# Altium project PCB_Project.PrjPcb
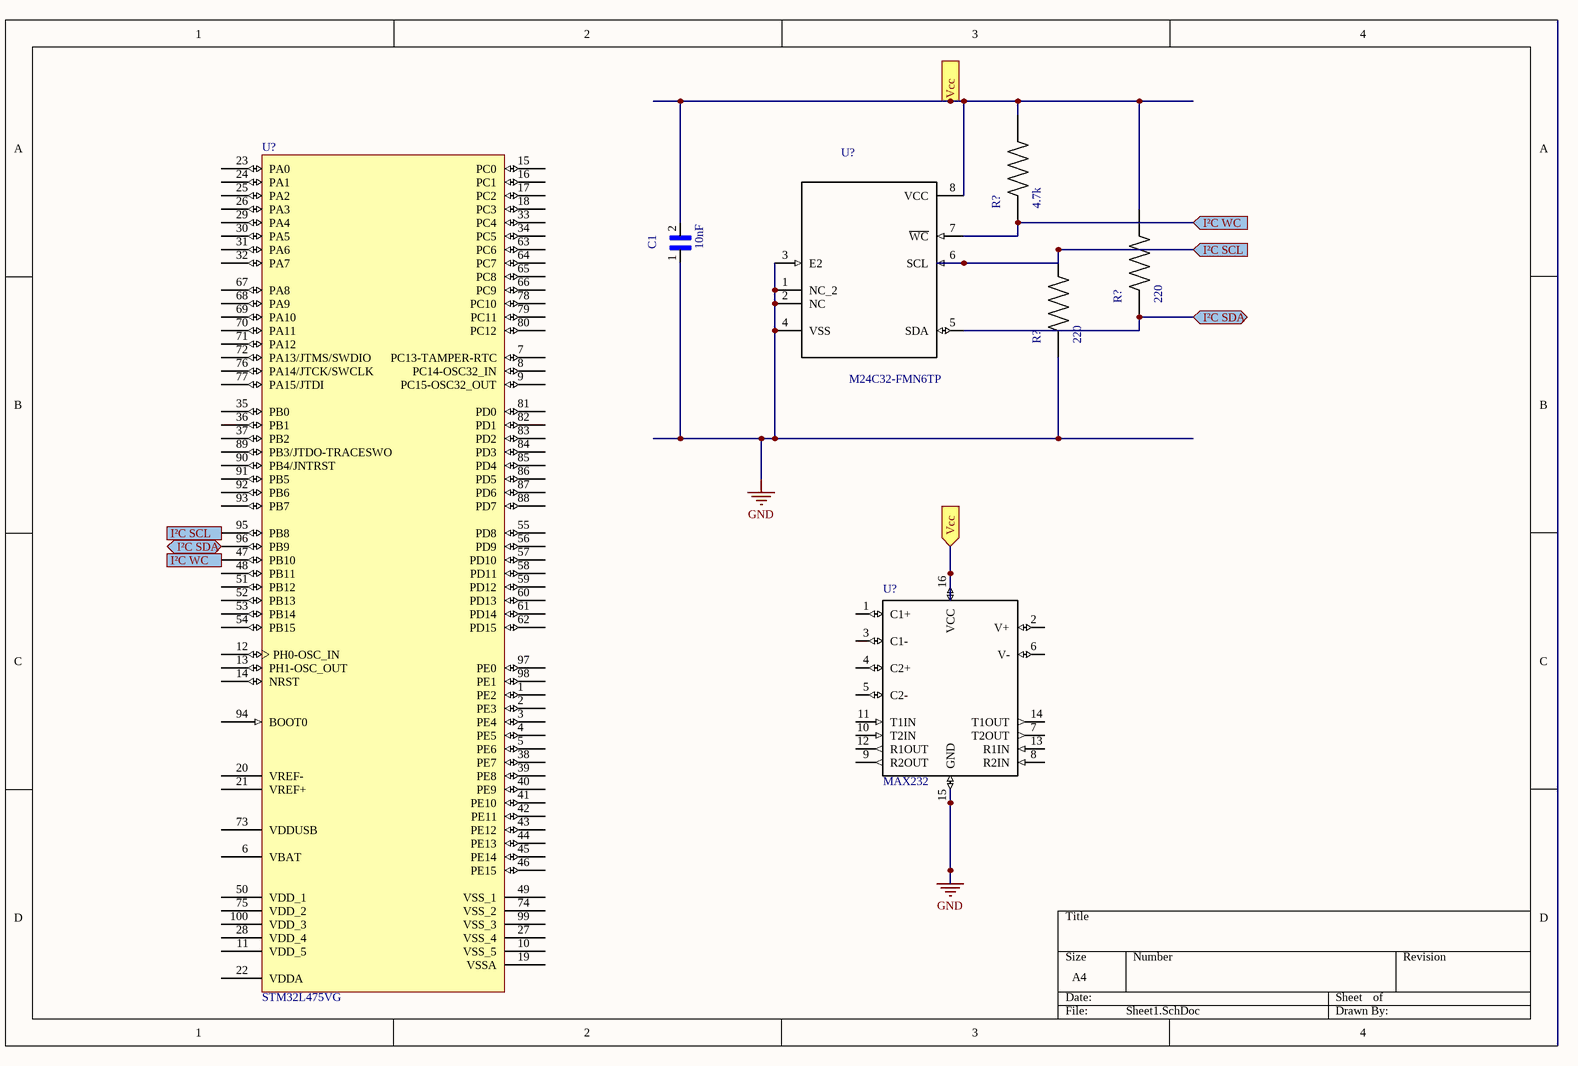
[diagram p0: Sheet1.SchDoc]
1 sheet, 7 parts. Net scope: flat (ports and power ports of the same name join across sheets).
Board file: PCB1.PcbDoc

## Sheet Sheet1.SchDoc
size A4

### Parts
(Parts that share a designator on the sheet are numbered #1, #2 ... from top to bottom, then left to right.)
C1  10nF  [*CAPC2012X88N]
R?#1  4.7k  [*RESC2012X65N]
R?#2  220  [*RESC2012X65N]
R?#3  220  [*RESC2012X65N]
U?#1  STM32L475VG  [LQFP100_L]
U?#2  M24C32-FMN6TP  [*SOIC127P600X175-8N]
U?#3  MAX232  [*SO016]

### Ports
I²C SCL (in), I²C SCL (out), I²C SDA (bidir), I²C WC (in), I²C WC (out), Vcc (in)

### Nets
GND: C1.1 R?#3.1 U?#2.1(NC_2) U?#2.2(NC) U?#2.3(E2) U?#2.4(VSS) U?#3.15(GND)
NetC1_2: C1.2 R?#1.2 R?#2.2 U?#2.8(VCC) U?#3.16(VCC) ; port Vcc
NetR?#1_1: R?#1.1 U?#1.47(PB10) U?#2.7(~{WC}) ; port I²C WC
NetR?#2_1: R?#2.1 U?#1.96(PB9) U?#2.5(SDA) ; port I²C SDA
NetR?#3_2: R?#3.2 U?#1.95(PB8) U?#2.6(SCL) ; port I²C SCL

Not connected (* = marked no-connect by the designer): U?#1 1(PE2) 2(PE3) 3(PE4) 4(PE5) 5(PE6) 6(VBAT) 7(PC13-TAMPER-RTC) 8(PC14-OSC32_IN) 9(PC15-OSC32_OUT) 10(VSS_5) 11(VDD_5) 12(PH0-OSC_IN) 13(PH1-OSC_OUT) 14(NRST) 15(PC0) 16(PC1) 17(PC2) 18(PC3) 19(VSSA) 20(VREF-) 21(VREF+) 22(VDDA) 23(PA0) 24(PA1) 25(PA2) 26(PA3) 27(VSS_4) 28(VDD_4) 29(PA4) 30(PA5) 31(PA6) 32(PA7) 33(PC4) 34(PC5) 35(PB0) 36(PB1) 37(PB2) 38(PE7) 39(PE8) 40(PE9) 41(PE10) 42(PE11) 43(PE12) 44(PE13) 45(PE14) 46(PE15) 48(PB11) 49(VSS_1) 50(VDD_1) 51(PB12) 52(PB13) 53(PB14) 54(PB15) 55(PD8) 56(PD9) 57(PD10) 58(PD11) 59(PD12) 60(PD13) 61(PD14) 62(PD15) 63(PC6) 64(PC7) 65(PC8) 66(PC9) 67(PA8) 68(PA9) 69(PA10) 70(PA11) 71(PA12) 72(PA13/JTMS/SWDIO) 73(VDDUSB) 74(VSS_2) 75(VDD_2) 76(PA14/JTCK/SWCLK) 77(PA15/JTDI) 78(PC10) 79(PC11) 80(PC12) 81(PD0) 82(PD1) 83(PD2) 84(PD3) 85(PD4) 86(PD5) 87(PD6) 88(PD7) 89(PB3/JTDO-TRACESWO) 90(PB4/JNTRST) 91(PB5) 92(PB6) 93(PB7) 94(BOOT0) 97(PE0) 98(PE1) 99(VSS_3) 100(VDD_3); U?#3 1(C1+) 2(V+) 3(C1-) 4(C2+) 5(C2-) 6(V-) 7(T2OUT) 8(R2IN) 9(R2OUT) 10(T2IN) 11(T1IN) 12(R1OUT) 13(R1IN) 14(T1OUT)

### Library data of the parts
C1 = C10nF_0805: 0805 C 10nF Ceramic Multilayer Capacitor, 200 VDC, +125degC, X7R Dielec, +/-10%; MF: KEMET; MP: C0805C103K2RACTU; Digi-Key_Part_Number: 399-7993-1-ND; SnapEDA_Link: https://www.snapeda.com/parts/C0805C103K2RACTU/KEMET/view-part/?ref=snap; Package: 2012 KEMET; Digi-Key_Purchase_URL: https://www.digikey.com/product-detail/en/kemet/C0805C103K2RACTU/399-7993-1-ND/3471716?utm_source=snapeda&utm_medium=aggregator&utm_campaign=symbol; Value: *
R?#1 = R4.7k_0805: / ESR Series 0805 220 O Â±1 % 0.4 W Â±100 ppm/Â°C SMT Anti-Surge Chip Resistor /; MF: Rohm; MP: ESR10EZPF2200; Digi-Key_Part_Number: RHM220AECT-ND; SnapEDA_Link: https://www.snapeda.com/parts/ESR10EZPF2200/Rohm/view-part/?ref=snap; Package: 2012 Rohm Semiconductor; Digi-Key_Purchase_URL: https://www.digikey.com/product-detail/en/rohm-semiconductor/ESR10EZPF2200/RHM220AECT-ND/1983835?utm_source=snapeda&utm_medium=aggregator&utm_campaign=symbol; Value: *
R?#2 R?#3 = R220_0805: / ESR Series 0805 220 O Â±1 % 0.4 W Â±100 ppm/Â°C SMT Anti-Surge Chip Resistor /; MF: Rohm; MP: ESR10EZPF2200; Digi-Key_Part_Number: RHM220AECT-ND; SnapEDA_Link: https://www.snapeda.com/parts/ESR10EZPF2200/Rohm/view-part/?ref=snap; Package: 2012 Rohm Semiconductor; Digi-Key_Purchase_URL: https://www.digikey.com/product-detail/en/rohm-semiconductor/ESR10EZPF2200/RHM220AECT-ND/1983835?utm_source=snapeda&utm_medium=aggregator&utm_campaign=symbol; Value: *
U?#1 = STM32L475VG: STM32 ARM-based 32-bit MCU with 1 Mbyte Flash, 100-pin LQFP; Published: 01-JUILLET-2018; DatasheetVersion: Juillet 2018Mar-2008; PackageVersion: JUI-2018; PackageReference: LQFP100; Publisher: Altium Limited; PackageDescription: 100-Pin Low-Profile Quad Flat Pack, 14 x 14 mm Body, 0.5 mm Pitch (LQFP100); ComponentLink1Description: Manufacturer Link; ComponentLink1URL: www.st.com/stm32; ComponentLink2Description: Datasheet; ComponentLink2URL: https://www.st.com/resource/en/datasheet/stm32l475vg.pdf
U?#2 = M24C32-FMN6TP: EEPROM Serial-I2C 32K-bit 4K x 8 1.8V/2.5V/3.3V/5V 8-Pin SOIC T/R; MF: STMicroelectronics; Package: SO-8 STMicroelectronics; MP: M24C32-FMN6TP; SnapEDA_Link: https://www.snapeda.com/parts/M24C32-FMN6TP/STMicroelectronics/view-part/?ref=snap; Digi-Key_Part_Number: 497-15758-1-ND; Digi-Key_Purchase_URL: https://www.digikey.com/product-detail/en/stmicroelectronics/M24C32-FMN6TP/497-15758-1-ND/5283322?utm_source=snapeda&utm_medium=aggregator&utm_campaign=symbol; Value: *
U?#3 = MAX232: Expansion board; D-Sub 9pin; In the set: prototype board; MF: Texas Instruments; Package: SOIC-16 Texas Instruments; MP: MAX232; SnapEDA_Link: https://www.snapeda.com/parts/MAX232/Texas%20Instruments/view-part/?ref=snap; Price: None; Availability: Unavailable; Value: *